# EAGLE design InWallDimmeSMD (EAGLE 6.6.0)
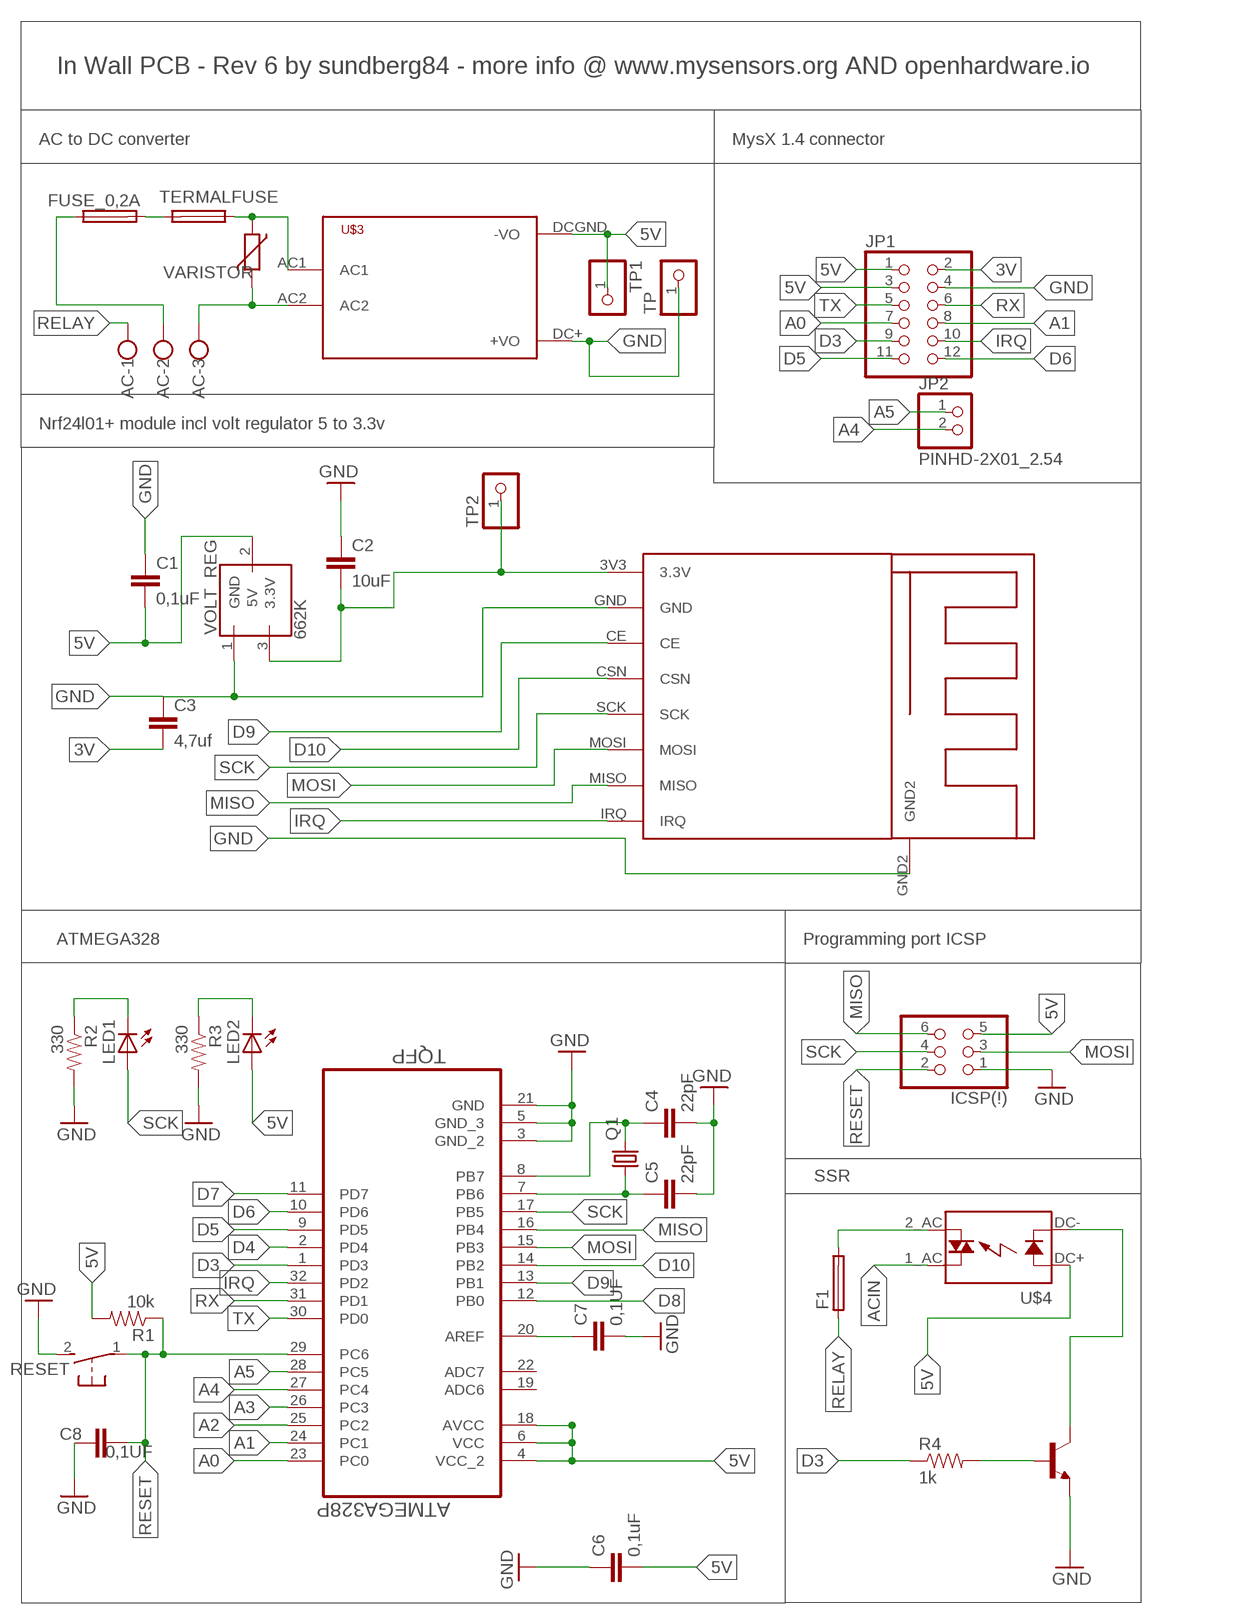
[diagram p0: schematic, sheet 1]

## Parts
AC  W237-103  [W237-103]
ATMEGA328  ATMEGA328P-AU  [QFP80P900X900X120-32N]
C1  0,1uF  CAP0805  [0805]
C2  10uF  CAP0805  [0805]
C3  4,7uf  CAP0805  [0805]
C4  22pF  CAP0805  [0805]
C5  22pF  CAP0805  [0805]
C6  0,1uF  CAP0805  [0805]
C7  0,1UF  CAP0805  [0805]
C8  0,1UF  CAP0805  [0805]
F1  19559  [19559]
FUSE_0,2A  FUSETE5  [TE5]
ICSP(!)  PINHD-2X03_2.54  [2X03]
J3Y  J3Y_S8050_SMD_NPN_TRANSISTOR  [SOT-23-3]
JP1  PINHD-2X06_2.54  [2X06]
JP2  PINHD-2X01_2.54  [2X01]
LED1  LEDCHIPLED_0805  [CHIPLED_0805]
LED2  LEDCHIPLED_0805  [CHIPLED_0805]
Q1  CRYSTALHC49S  [HC49/S]
R1  10k  RESISTOR0805-RES  [0805]
R2  330  RESISTOR0805-RES  [0805]
R3  330  RESISTOR0805-RES  [0805]
R4  1k  RESISTOR0805-RES  [0805]
RESET  DTSM-3  [DTSM-3]
TERMALFUSE  FUSETE5  [TE5]
TP  PINHD-1X1  [1X01]
TP1  PINHD-1X1  [1X01]
TP2  PINHD-1X1  [1X01]
U$1  SMD24L01+SMD  [NRF24L01+SMD]
U$3  HLK-PM01  [HLK-PM01]
U$4  OMRON_G3MC-202PL_5V_SSR  [OMRON_G3MC_202PL_5V_SSR]
VARISTOR  VARISTOR-7,5  [R-7,5]
VOLT_REG  662K  [SOT-23-3]

## Nets
3V: C2.2 C3.2 JP1.2 TP2.1 U$1.3V3(3.3V) VOLT_REG.3(3.3V)
5V: ATMEGA328.4(VCC_2) ATMEGA328.6(VCC) ATMEGA328.18(AVCC) C1.2 C6.2 ICSP(!).5 JP1.1 JP1.3 LED2.A R1.2 TP1.1 U$3.DCGND(-VO) U$4.DC+(DCSIGNAL) VOLT_REG.2(5V)
A0: ATMEGA328.23(PC0) JP1.7
A1: ATMEGA328.24(PC1) JP1.8
A2: ATMEGA328.25(PC2)
A3: ATMEGA328.26(PC3)
A4: ATMEGA328.27(PC4) JP2.2
A5: ATMEGA328.28(PC5) JP2.1
ACGND: AC.3 U$3.AC2 VARISTOR.2
ACIN: AC.2 FUSE_0,2A.1 U$4.1_AC(HOT)
D3: ATMEGA328.1(PD3) JP1.9 R4.1
D4: ATMEGA328.2(PD4)
D5: ATMEGA328.9(PD5) JP1.11
D6: ATMEGA328.10(PD6) JP1.12
D7: ATMEGA328.11(PD7)
D8: ATMEGA328.12(PB0)
D9: ATMEGA328.13(PB1) U$1.CE
D10: ATMEGA328.14(PB2) U$1.CSN
GND: ATMEGA328.3(GND_2) ATMEGA328.5(GND_3) ATMEGA328.21(GND) C1.1 C2.1 C3.1 C4.2 C5.2 C6.1 C7.2 C8.1 ICSP(!).1 J3Y.3(E) JP1.4 R2.2 R3.2 RESET.2 TP.1 U$1.GND U$1.GND2 U$3.DC+(+VO) VOLT_REG.1(GND)
IRQ: ATMEGA328.32(PD2) JP1.10 U$1.IRQ
MISO: ATMEGA328.16(PB4) ICSP(!).6 U$1.MISO
MOSI: ATMEGA328.15(PB3) ICSP(!).3 U$1.MOSI
N$1: FUSE_0,2A.2 TERMALFUSE.2
N$3: LED1.C R2.1
N$4: F1.2 U$4.2_AC(NEUTRAL)
N$5: ATMEGA328.8(PB7) C4.1 Q1.2
N$6: LED2.C R3.1
N$7: TERMALFUSE.1 U$3.AC1 VARISTOR.1
N$8: ATMEGA328.7(PB6) C5.1 Q1.1
N$10: ATMEGA328.20(AREF) C7.1
N$14: J3Y.1(B) R4.2
N$15: J3Y.2(C) U$4.DC-(DCGND)
RELAY: AC.1 F1.1
RESET: ATMEGA328.29(PC6) C8.2 ICSP(!).2 R1.1 RESET.1
RX: ATMEGA328.31(PD1) JP1.6
SCK: ATMEGA328.17(PB5) ICSP(!).4 LED1.A U$1.SCK
TX: ATMEGA328.30(PD0) JP1.5
Unconnected: ATMEGA328.19(ADC6) ATMEGA328.22(ADC7)

## Notes on the sheet
- In Wall PCB - Rev 6 by sundberg84 - more info @ www.mysensors.org AND openhardware.io
- AC to DC converter | MysX 1.4 connector
- Nrf24l01+ module incl volt regulator 5 to 3.3v
- ATMEGA328 | Programming port ICSP
- SSR

## Library data of the parts
AC = con-wago-500:W237-103: WAGO SCREW CLAMP; MPN: 237-103; OC_FARNELL: unknown; OC_NEWARK: 18M7116
ATMEGA328 = Ava:ATMEGA328P-AU; DESCRIPTION: 8-bit Microcontroller with In-System Programmable Flash; MPN: ATMEGA328P-AU; OC_FARNELL: 1715486; OC_NEWARK: 14R4631; PACKAGE: TQFP-32; SUPPLIER: Atmel
C1-C8 = SparkFun-Capacitors:CAP: Capacitor Standard 0603 ceramic capacitor, and 0.1" leaded capacitor.
F1 = fuse:19559: FUSE HOLDER TR5, Wickmann; MPN: 55900000001; OC_FARNELL: 9516360; OC_NEWARK: 02P0286
FUSE_0,2A TERMALFUSE = fuse:FUSE: Fuse; OC_FARNELL: unknown; OC_NEWARK: unknown
ICSP(!) = pinhead-2:PINHD-2X03: PIN HEADER
J3Y = Sundberg:J3Y_S8050_SMD_NPN_TRANSISTOR
JP1 = pinhead-2:PINHD-2X06: PIN HEADER
JP2 = pinhead-2:PINHD-2X01
LED1 LED2 = led:LED: LED OSRAM: - CHIPLED LG R971, LG N971, LY N971, LG Q971, LY Q971, LO R971, LY R971 LH N974, LH R974 LS Q976, LO Q976, LY Q976 LO Q996 - Hyper CHIPLED LW Q18S LB Q993, LB Q99A, LB R99A - SideLED LS A670, LO A670, LY A670, LG A670, LP A670 LB A673, LV A673, LT A673, LW A673 LH A674 LY A675 LS A676, LA A676, LO A676, LY A676, LW A676 LS A679, LY A679, LG A679 - Hyper Micro SIDELED® LS Y876, LA Y876, LO Y876, LY Y876 LT Y87S - SmartLED LW L88C, LW L88S LB L89C, LB L89S, LG L890 LS L89K, LO L89K, LY L89K LS L896, LA L896, LO L896, LY L896 - TOPLED LS T670, LO T670, LY T670, LG T670, LP T670 LSG T670, LSP T670, LSY T670, LOP T670, LYG T670 LG T671, LOG T671, LSG T671 LB T673, LV T673, LT T673, LW T673 LH T674 LS T676, LA T676, LO T676, LY T676, LB T676, LH T676, LSB T676, LW T676 LB T67C, LV T67C, LT T67C, LS T67K, LO T67K, LY T67K, LW E67C LS E67B, LA E67B, LO E67B, LY E67B, LB E67C, LV E67C, LT E67C LW T67C LS T679, LY T679, LG T679 LS T770, LO T770, LY T770, LG T770, LP T770 LB T773, LV T773, LT T773, LW T773 LH T774 LS E675, LA E675, LY E675, LS T675 LS T776, LA T776, LO T776, LY T776, LB T776 LHGB T686 LT T68C, LB T68C - Hyper Mini TOPLED® LB M676 - Mini TOPLED Santana® LG M470 LS M47K, LO M47K, LY M47K Source: http://www.osram.convergy.de LUXEON: - LUMILED® LXK2-PW12-R00, LXK2-PW12-S00, LXK2-PW14-U00, LXK2-PW14-V00 LXK2-PM12-R00, LXK2-PM12-S00, LXK2-PM14-U00 LXK2-PE12-Q00, LXK2-PE12-R00, LXK2-PE12-S00, LXK2-PE14-T00, LXK2-PE14-U00 LXK2-PB12-K00, LXK2-PB12-L00, LXK2-PB12-M00, LXK2-PB14-N00, LXK2-PB14-P00, LXK2-PB14-Q00 LXK2-PR12-L00, LXK2-PR12-M00, LXK2-PR14-Q00, LXK2-PR14-R00 LXK2-PD12-Q00, LXK2-PD12-R00, LXK2-PD12-S00 LXK2-PH12-R00, LXK2-PH12-S00 LXK2-PL12-P00, LXK2-PL12-Q00, LXK2-PL12-R00 Source: www.luxeon.com KINGBRIGHT: KA-3528ASYC Source: www.kingbright.com
Q1 = crystal:CRYSTAL: CRYSTAL; OC_FARNELL: 1667008; OC_NEWARK: unknown
R1-R4 = SparkFun-Passives:RESISTOR: Resistor Basic schematic elements and footprints for 0603, 1206, and PTH resistors.
RESET = switch-tact:DTSM-3
TP TP1 TP2 = pinhead:PINHD-1X1: PIN HEADER
U$1 = Sundberg:SMD24L01+SMD
U$3 = Sundberg:HLK-PM01
U$4 = Sundberg:OMRON_G3MC-202PL_5V_SSR: G3MC Solid State Relays Reinforced Insulation Models Added to Compact, Thin-profile Series of SSRs for PCBs • 4.5-mm thin design for high-density PCB applications. • DC input and AC output for applicable load of 1A (at 40°C) and 2A (at 25°C). • Compact, thin-profile SSR of monoblock construction with an all-in-one lead frame incorporates a PCB, terminals and heat sink
VARISTOR = varistor:VARISTOR: VARISTOR
VOLT_REG = Sundberg:662K

## Board
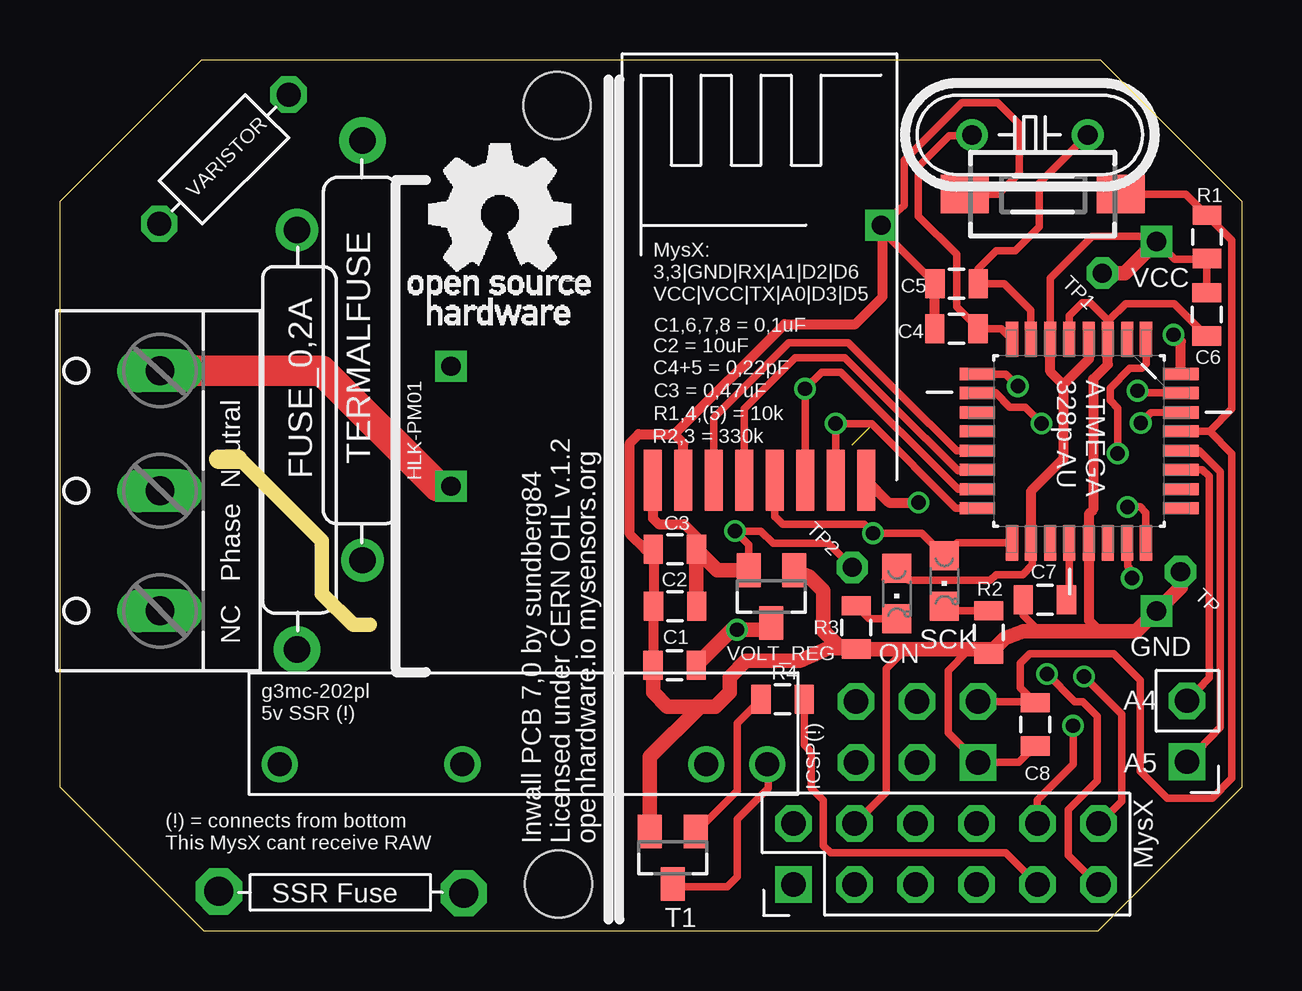
[diagram p1: board, top side]
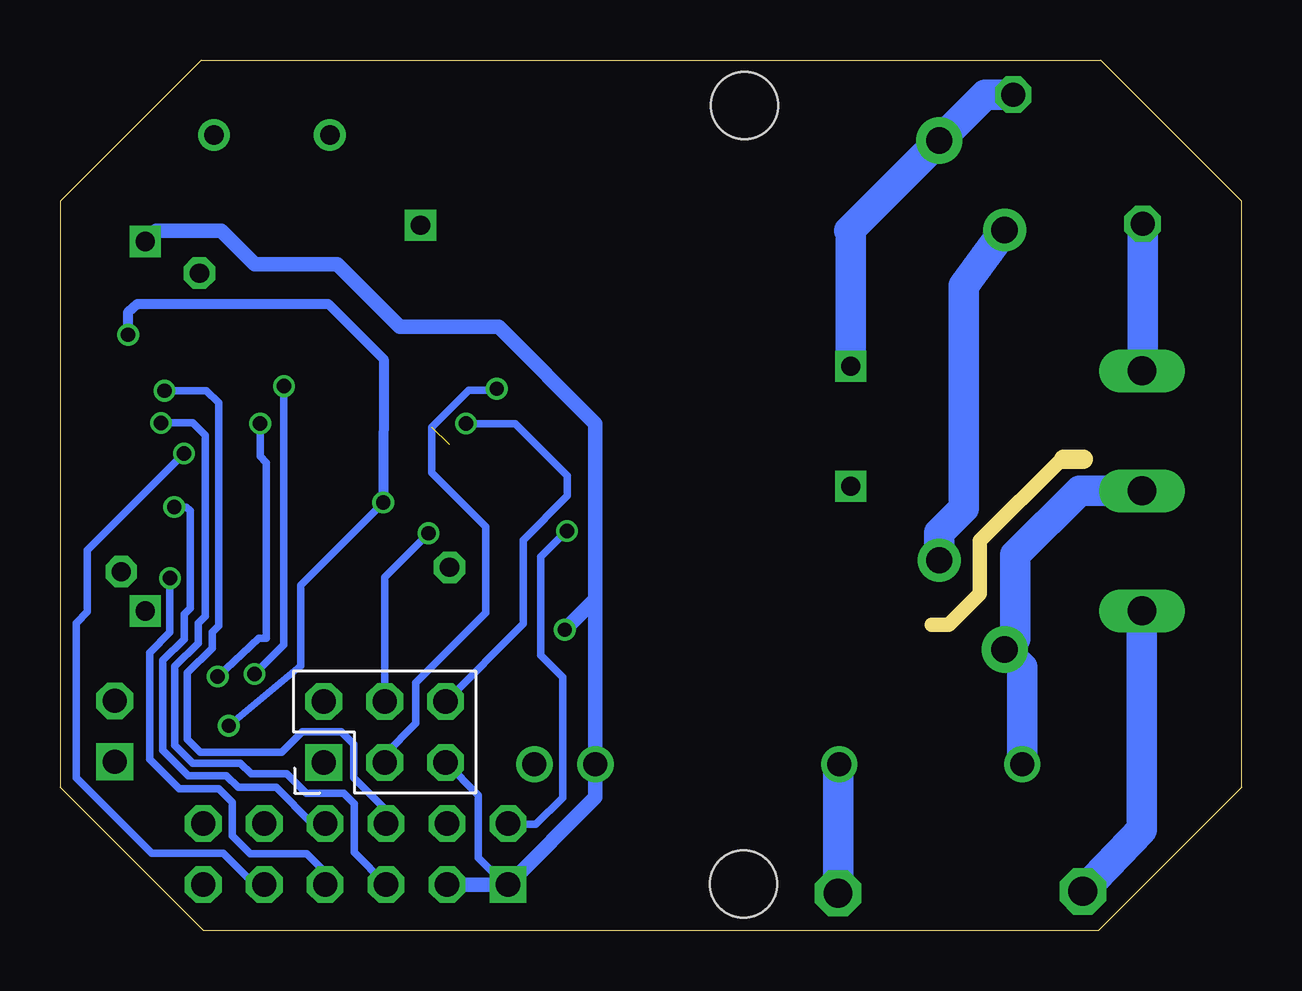
[diagram p2: board, bottom side, seen from below]

Size 49.24 x 36.28 mm. Coordinates in mm from the lower left corner, seen from the top.
Outline: 43.36,36.28 5.88,36.28 0,30.4 0,5.98 5.98,0 43.26,0 49.24,5.98 49.24,30.4 43.36,36.28
Copper layers (1*16): Top 0.035mm / dielectric 1.5mm / Bottom 0.035mm
Design rules "ITead_rule": minimum track width 6mil, minimum drill 12mil, track to track 6mil, track to pad 6mil, pad to pad 6mil, via to via 6mil, smd to smd 0mil, copper to edge 10mil, drill to drill 10mil, minimum pad ring 10mil, minimum via ring 6mil, stop-mask expansion 2mil, vias tented up to drill 100mil, thermal gap 10mil
Holes 2.8 mm at 20.77,1.95 20.72,34.38
Milling: 5 lines

### Footprints (pad centres in the part's own frame; a part is rotated, then mirrored left to right if it is on the bottom)
W237-103 = drill 1.194 long: 1 -5,-1.29; 2 0,-1.29; 3 5,-1.29
QFP80P900X900X120-32N = smd 1.473 x 0.508: 1 -4.242,2.794; 2 -4.242,2.007; 3 -4.242,1.194; 4 -4.242,0.406; 5 -4.242,-0.406; 6 -4.242,-1.194; 7 -4.242,-2.007; 8 -4.242,-2.794; 17 4.242,-2.794; 18 4.242,-2.007; 19 4.242,-1.194; 20 4.242,-0.406; 21 4.242,0.406; 22 4.242,1.194; 23 4.242,2.007; 24 4.242,2.794 | smd 0.508 x 1.473: 9 -2.794,-4.242; 10 -2.007,-4.242; 11 -1.194,-4.242; 12 -0.406,-4.242; 13 0.406,-4.242; 14 1.194,-4.242; 15 2.007,-4.242; 16 2.794,-4.242; 25 2.794,4.242; 26 2.007,4.242; 27 1.194,4.242; 28 0.406,4.242; 29 -0.406,4.242; 30 -1.194,4.242; 31 -2.007,4.242; 32 -2.794,4.242
0805 = smd 0.8 x 1.2: 1 -0.9,0; 2 0.9,0
19559 = drill 1.2 pad 1.93 octagon: 1 -6.31,0.04; 2 3.89,-0.04
TE5 = drill 1.1 pad 1.93: 1 -5.632,0 | drill 1.1 pad 1.778: 2 11.852,0
2X03 = drill 1.016 square: 1 -2.54,-1.27 | drill 1.016 octagon: 2 -2.54,1.27; 3 0,-1.27; 4 0,1.27; 5 2.54,-1.27; 6 2.54,1.27
SOT-23-3 = smd 1 x 1.4: 1 -0.97,-1.1; 2 -0.02,1.1; 3 0.93,-1.1
2X06 = drill 1.016 square: 1 -6.35,-1.27 | drill 1.016 octagon: 2 -6.35,1.27; 3 -3.81,-1.27; 4 -3.81,1.27; 5 -1.27,-1.27; 6 -1.27,1.27; 7 1.27,-1.27; 8 1.27,1.27; 9 3.81,-1.27; 10 3.81,1.27; 11 6.35,-1.27; 12 6.35,1.27
2X01 = drill 1.016 square: 1 -1.27,-1.27 | drill 1.016 octagon: 2 -1.27,1.27
CHIPLED_0805 = smd 1.2 x 1.2: A 0,-1.05; C 0,1.05
HC49/S = drill 0.813: 1 -2.413,0; 2 2.413,0
DTSM-3 = smd 2 x 1.6: 1 -3.25,0; 2 3.25,0
1X01 = drill 0.8 octagon: 1 0,0
NRF24L01+SMD = smd 2.54 x 0.762: 3V3 -8.89,3.81; CE -8.89,1.27; CSN -8.89,0; GND -8.89,2.54; IRQ -8.89,-5.08; MISO -8.89,-3.81; MOSI -8.89,-2.54; SCK -8.89,-1.27 | drill 0.8 square: GND2 1.735,-5.705
HLK-PM01 = drill 0.8 square: AC1 -14.7,2.5; AC2 -14.7,-2.5; DC+ 14.7,-7.7; DCGND 14.7,7.7
OMRON_G3MC_202PL_5V_SSR = drill 1: 1_AC 10.16,0; 2_AC 2.54,0; DC+ -7.62,0; DC- -10.16,0
R-7,5 = drill 1 octagon: 1 -3.81,0; 2 3.81,0

### Placement (x,y rotation side)
AC  2.87,18.33 90 top
ATMEGA328  42.46,20.4 270 top
C1  25.61,11.06 0 top
C2  25.63,13.52 0 top
C3  25.62,15.89 0 top
C4  37.35,25.08 180 top
C5  37.36,26.96 180 top
C6  47.78,25.68 90 top
C7  41.04,13.79 180 top
C8  40.64,8.59 90 top
F1  12.93,1.6 0 top
FUSE_0,2A  9.88,17.35 90 top
ICSP(!)  35.71,8.28 0 bottom
J3Y  25.51,3.04 180 top
JP1  36.92,3.19 0 top
JP2  48.23,8.31 0 top
LED1  36.85,14.57 180 top
LED2  34.87,14.05 180 top
Q1  40.41,33.16 180 top
R1  47.79,28.91 270 top
R2  38.7,12.43 270 top
R3  33.17,12.63 270 top
R4  30.11,9.64 180 top
RESET  40.94,30.69 180 top
TERMALFUSE  12.6,27.29 270 top
TP  46.69,14.96 0 top
TP1  43.43,27.4 0 top
TP2  33.01,15.14 0 top
U$1  28.51,27.66 90 top
U$3  30.99,21.02 0 top
U$4  19.31,6.94 180 top
VARISTOR  6.83,32.15 225 top
VOLT_REG  29.62,13.92 180 top

### Tracks (layer width: path | path; a pad name or v marks a point on that pad's centre or on a via)
3V  (via drill 0.6)
  Top 0.305: VOLT_REG.3 28.69,16.08 v28.12,16.65 29.2,16.65 29.71,16.14 32.01,16.14 TP2.1 | 24.7,18.21 U$1.3V3
  Top 0.406: 24.7,17.7 24.7,18.21 24.71,18.2 24.71,17.17 24.94,16.94 26.01,16.94 26.52,16.43 C3.2
  Top 0.61: 27.83,15.02 VOLT_REG.3 27.39,15.02 C3.2 26.52,13.73 C2.2
  Bottom 0.305: v28.12,16.65 28.15,16.65 29.21,15.59 29.21,11.47 28.3,10.56 28.3,5.55 29.41,4.44 30.55,4.44 JP1.2
5V  (via drill 0.6)
  Top 0.305: 34.39,14.62 LED2.A 35.37,14.6 38.77,14.6 39.01,14.84 40.11,14.84 40.51,15.24 40.51,16.1 ATMEGA328.18 40.47,16.14 | R1.2 48.24,27.94 | R1.2 47.75,27.97 46.44,27.97 U$3.DCGND | C6.2 R1.2 | ATMEGA328.6 41.27,27.2 43.01,28.94 45.47,28.94 U$3.DCGND | 45.45,28.96 U$3.DCGND
  Top 0.406: ATMEGA328.18 40.45,18.3 41.81,19.66 41.81,22.76 | 41.81,22.76 41.27,23.3 ATMEGA328.6 | ATMEGA328.4 42.87,23.82 41.81,22.76
  Top 0.61: TP1.1 44.37,27.4 U$3.DCGND | VOLT_REG.2 29.6,12.61 29.53,12.54 v28.21,12.54 27.99,12.54 C1.2
  Bottom 0.305: JP1.1 30.57,1.8 | ICSP(!).5 31.81,5.65 31.81,3.04 31.11,2.34 31.11,1.92
  Bottom 0.61: JP1.3 31.11,1.92 JP1.1 26.93,5.56 U$4.DC+ 26.93,13.82 | 26.93,13.82 26.93,21.13 30.96,25.16 35.08,25.16 37.68,27.76 41.12,27.76 42.53,29.17 45.24,29.17 U$3.DCGND | v28.21,12.54 26.93,13.82
A0  (via drill 0.6)
  Top 0.305: ATMEGA328.23 44.48,16.14 44.48,15.18 44.66,15 v44.66,14.69
  Bottom 0.305: JP1.7 38.19,2.44 38.95,3.2 41.31,3.2 42.06,3.95 42.06,5.36 42.62,5.92 44.28,5.92 45.51,7.15 45.51,11.59 44.66,12.44 v44.66,14.69
A1  (via drill 0.6)
  Top 0.305: 45.28,16.13 ATMEGA328.24 45.24,16.17 45.24,17.42 45,17.66 v44.49,17.66 v44.48,17.65
  Bottom 0.305: v44.48,17.65 43.97,17.65 43.81,17.49 43.81,13.44 44.06,13.19 44.06,12.15 44.95,11.26 44.95,7.51 43.9,6.46 42.31,6.46 41.82,5.97 40.24,5.97 38.73,4.46 JP1.8
A4
  Top 0.305: JP2.2 47.88,10.55 47.88,18.93 47.6,19.21 ATMEGA328.27
A5
  Top 0.305: ATMEGA328.28 47.47,19.99 48.34,19.12 48.34,8.47 JP2.1
ACGND
  Top 1.27: U$3.AC2 15.73,18.52 10.91,23.34 AC.3
  Bottom 1.27: AC.3 4.13,23.36 VARISTOR.2
ACIN
  Bottom 1.27: AC.2 6.76,18.33 9.43,15.66 9.43,12.16 FUSE_0,2A.1 9.15,10.99 U$4.1_AC
D3  (via drill 0.6)
  Top 0.305: v44.07,19.89 44.07,21.78 43.75,22.1 43.75,22.61 44.57,23.43 45.07,23.43 45.27,23.63 45.27,24.63 ATMEGA328.1 | JP1.9 39.41,3.24 32.11,3.24 31.81,3.54 31.81,5.44 31.31,5.94 31.31,7.44 31.01,7.74 R4.1
  Bottom 0.305: JP1.9 41.13,1.92 42.44,3.23 45.42,3.23 48.57,6.38 48.57,12.82 48.1,13.29 48.1,15.86 v44.07,19.89
D5  (via drill 0.6)
  Top 0.305: v39.91,22.69 39.41,23.19 ATMEGA328.9 | v41.13,10.7 42.29,9.54 42.61,9.54 43.21,8.94 43.21,6.24 42.01,5.04 42.01,3.14 43.23,1.92 JP1.11
  Bottom 0.305: v41.13,10.7 39.91,11.92 v39.91,22.69
D6  (via drill 0.6)
  Top 0.305: 38.23,22.39 ATMEGA328.10 38.98,22.41 39.57,21.82 40.21,21.82 v40.9,21.13 | v42.67,10.59 44.24,9.02 44.24,5.4 43.3,4.46 JP1.12
  Bottom 0.305: v40.9,21.13 40.9,19.76 40.64,19.5 40.64,12.18 40.96,12.18 v42.67,10.59
D9
  Top 0.305: ATMEGA328.13 37.36,19.99 36.23,21.12 36.22,21.12 32.85,24.49 30.36,24.49 27.24,21.37 U$1.CE
D10
  Top 0.305: 38.19,19.18 ATMEGA328.14 38.18,19.17 37.43,19.17 36.08,20.52 36.06,20.52 32.7,23.88 30.64,23.88 28.51,21.75 U$1.CSN
GND
  Top 0.305: 36.46,27.11 C5.2 34.21,29.2 U$1.GND2 35.18,30.22 35.18,32.11 37.57,34.5 39.08,34.5 39.97,33.61 39.97,31.57 39.09,30.69 RESET.2 | C6.1 46.43,26.13 44.4,26.13 43.68,25.41 43.68,24.67 ATMEGA328.3 43.65,25.45 42.93,26.17 42.6,26.17 42.05,25.62 ATMEGA328.5 | 38.62,11.45 R2.2 | 35.07,11.74 35.07,11.57 34.42,10.92 34.42,5.77 JP1.4 | C7.2 40.14,13.14 40.81,12.47 | 37.81,11.74 37.81,11.64 37.01,10.84 37.01,8.25 ICSP(!).1 39.95,7.01 C8.1
  Top 0.406: 42.88,16.17 ATMEGA328.21 | ATMEGA328.3 43.66,23.59 43.05,22.98 43.05,17.55 42.87,17.37 ATMEGA328.21 | ATMEGA328.21 | 43.33,12.47 42.87,12.93 ATMEGA328.21 | 25.6,20.69 24.11,20.69 23.74,20.32 23.74,16.53 24.38,15.89 C3.1 C2.1 24.71,13.7 C1.1 | U$1.GND2 34.28,29.19 34.28,26.42 33.14,25.28 30.19,25.28 25.6,20.69 | C4.2 36.45,26.95 C5.2 | U$1.GND 25.97,20.32 25.6,20.69
  Top 0.61: R3.2 | R3.2 35.07,11.74 37.81,11.74 38.9,11.74 | R3.2 | R2.2 38.9,11.74 | 38.9,11.74 39.36,12.19 40.14,12.47 40.81,12.47 43.33,12.47 44.84,12.47 U$3.DC+ 46.69,14.32 TP.1 | R3.2 32.7,11.74 32.64,11.8 32.62,11.78 32.53,11.78 | 32.53,11.78 32.02,11.78 30.83,11.24 28.58,11.24 27.91,10.57 27.91,9.94 27.31,9.34 26.68,9.34 | VOLT_REG.1 31.2,14.77 31.81,14.16 31.81,12.5 32.53,11.78 | J3Y.3 24.58,7.24 26.68,9.34 | C1.1 24.71,9.94 25.31,9.34 26.68,9.34
IRQ  (via drill 0.6)
  Top 0.305: v42.21,8.54 42.21,6.94 40.71,5.44 40.71,4.48 JP1.10
  Top 0.406: ATMEGA328.32 46.7,24.55 v46.4,24.83 | v35.77,17.84 34.54,17.84 33.61,18.77 U$1.IRQ
  Bottom 0.305: v35.77,17.84 39.21,14.4 39.21,11.04 v42.21,8.54
  Bottom 0.406: v46.4,24.83 46.4,25.76 46.01,26.12 38.07,26.12 35.76,23.81 v35.77,17.84
MISO  (via drill 0.6)
  Top 0.305: 37.89,17.61 ATMEGA328.16 37.32,17.61 33.82,21.12 v32.32,21.13 U$1.MISO
  Bottom 0.305: v32.32,21.13 30.27,21.13 28.1,18.96 28.1,18.12 28.09,18.12 29.93,16.28 29.93,12.79 ICSP(!).6
MOSI  (via drill 0.6)  (1 unrouted)
  Top 0.305: 37.89,18.4 ATMEGA328.15 37.42,18.39 32.53,23.28 31.74,23.28 v31.04,22.58 v31.05,22.57 U$1.MOSI
  Bottom 0.305: v31.04,22.58 31.1,22.52 32.2,22.52 33.74,20.98 33.74,19.07 31.51,16.84 31.51,13.24 34.41,10.34 34.41,8.64 35.71,7.34 ICSP(!).3
N$1
  Bottom 1.27: TERMALFUSE.2 12.6,16.59 11.58,17.61 11.58,26.88 FUSE_0,2A.2
N$3
  Top 0.305: R2.1 37.04,13.33 LED1.C
N$4
  Bottom 1.27: F1.2 16.82,6.89 U$4.2_AC
N$5
  Top 0.305: ATMEGA328.8 39.23,25.08 C4.1 38.25,25.1 37.36,25.99 37.36,28.18 35.76,29.78 35.76,31.83 37.06,33.13 37.97,33.13 Q1.2
N$6
  Top 0.305: LED2.C 33.71,13 R3.1
N$7
  Bottom 1.27: VARISTOR.1 10.68,34.84 TERMALFUSE.1 16.35,29.18 16.29,29.12 U$3.AC1
N$8
  Top 0.305: ATMEGA328.7 40.45,25.86 39.35,26.96 C5.1 38.26,27.59 39.01,28.34 39.81,28.34 40.81,29.34 40.81,31.15 Q1.1
N$10
  Top 0.305: 42.08,16.19 ATMEGA328.20 42.05,13.8 C7.1
N$14
  Top 0.305: J3Y.1 26.48,4.11 28.21,5.84 28.21,8.64 R4.2
N$15
  Top 0.305: U$4.DC- 29.51,6.9 29.51,5.94 28.21,4.64 28.21,2.24 27.81,1.84 25.63,1.84 J3Y.2
RELAY
  Bottom 1.27: F1.1 4.16,4.2 AC.1
RESET
  Top 0.305: RESET.1 46.91,30.69 R1.1 48.83,28.77 48.83,21.74 47.9,20.81 | ICSP(!).2 40.58,9.55 C8.2 40.01,10.12 40.01,11.14 40.41,11.54 43.91,11.54 45.01,10.44 45.01,6.65 46.14,5.52 48,5.52 48.83,6.35 48.83,19.87 47.9,20.81 | ATMEGA328.29 47.9,20.81
RX  (via drill 0.6)
  Top 0.305: ATMEGA328.31 44.98,22.41 v44.89,22.5
  Bottom 0.305: v44.89,22.5 43.14,22.5 42.63,21.99 42.63,12.7 42.9,12.43 42.9,11.78 43.93,10.75 43.93,7.98 43.39,7.44 40.01,7.44 39.15,8.3 37.52,8.3 37,7.78 37,6.37 35.65,5.02 JP1.6
SCK  (via drill 0.6)
  Top 0.305: ATMEGA328.17 37.39,16.16 LED1.A 35.91,16.56 v33.88,16.56 33.5,16.94 30.11,16.94 29.8,17.25 29.78,17.25 U$1.SCK | 29.75,18.8 U$1.SCK | 29.78,17.78 U$1.SCK
  Bottom 0.305: v33.88,16.57 v33.88,16.56 35.71,14.73 ICSP(!).4
TX  (via drill 0.6)
  Top 0.305: v45.03,21.15 45.45,21.58 ATMEGA328.30
  Bottom 0.305: v45.03,21.15 v45.02,21.16 43.7,21.16 43.19,20.65 43.19,13.11 43.49,12.81 43.49,11.98 44.45,11.02 44.45,7.72 43.71,6.98 41.72,6.98 41.28,6.54 39.79,6.54 38.98,5.73 37.42,5.73 36.99,5.3 36.99,3.26 JP1.5

### Text on the board
tPlace: MysX: / 3,3|GND|RX|A1|D2|D6 / VCC|VCC|TX|A0|D3|D5 | VCC | C1,6,7,8 = 0,1uF | C2 = 10uF / C4+5 = 0,22pF | C3 = 0,47uF | ATMEGA / 328p-AU | R1,4,(5) = 10k | R2,3 = 330k | HLK-PM01 | NC Phase Neutral | ON | SCK | GND | A4 | g3mc-202pl / 5v SSR (!) | A5 | (!) = connects from bottom / This MysX cant receive RAW | Inwall PCB 7,0 by sundberg84 | Licensed under CERN OHL v.1.2 | openhardware.io mysensors.org | MysX | SSR Fuse | T1